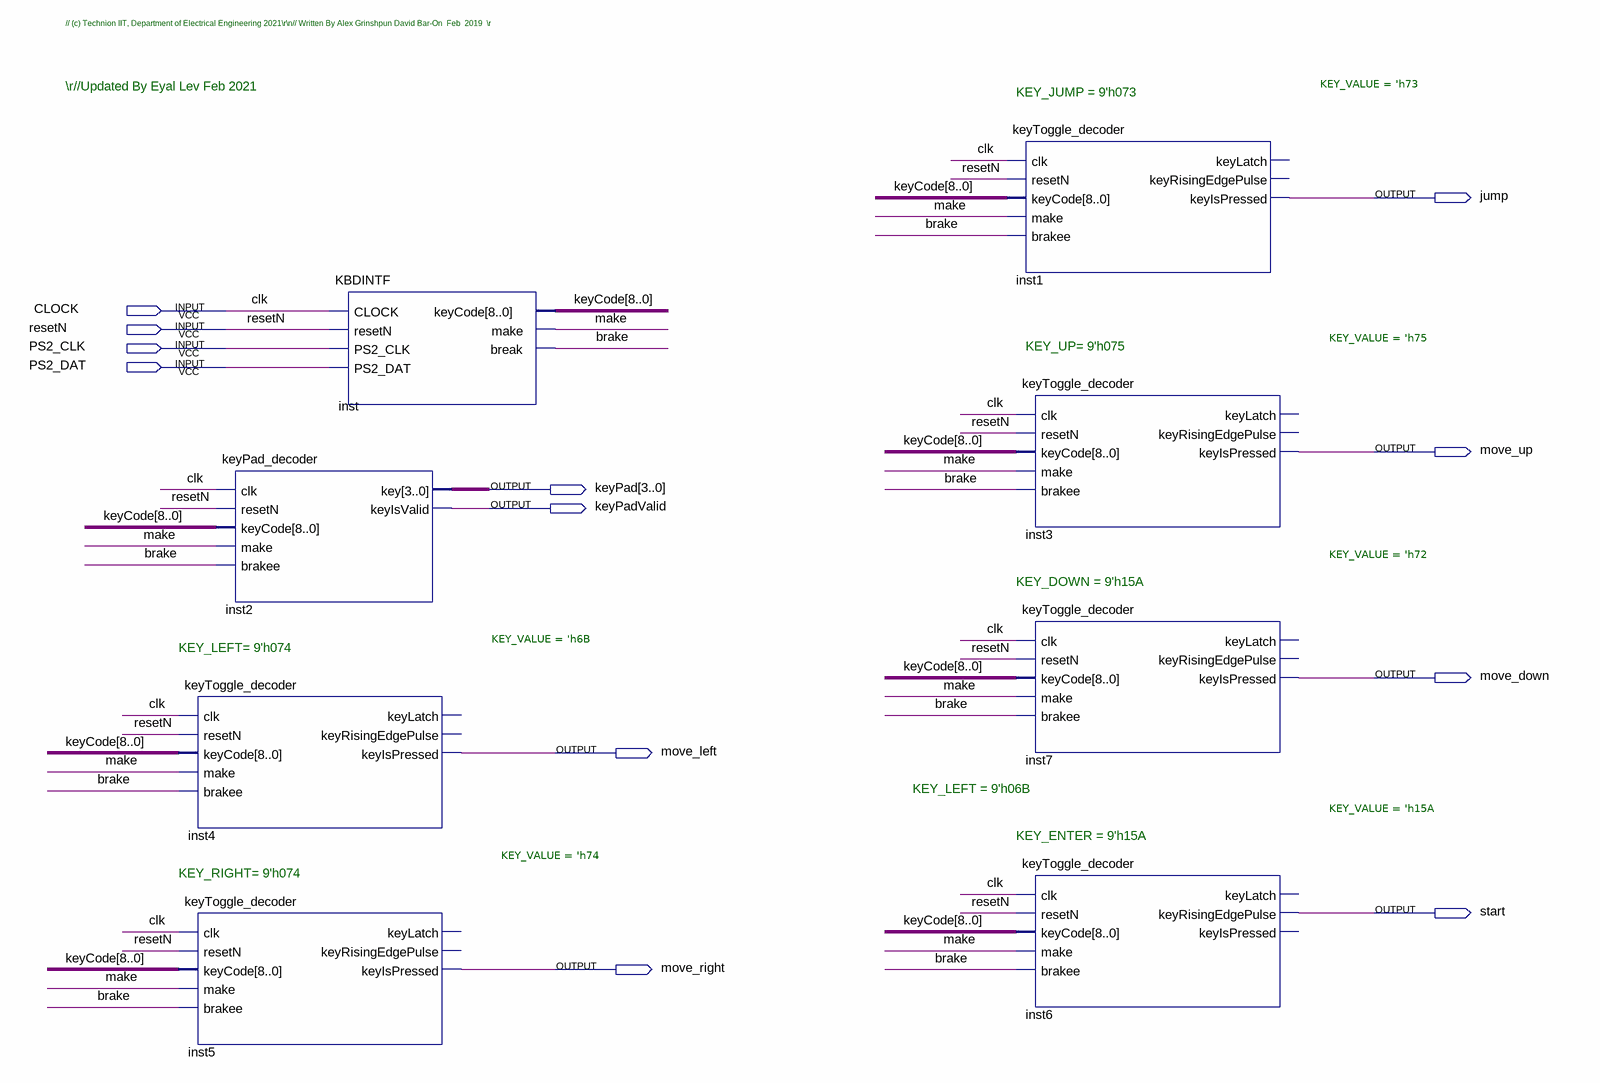
[diagram p0: schematic sheet]
// Quartus schematic KEYBOARD_INTERFACE.bdf as structural Verilog: 8 symbols, 12 pins
module KEYBOARD_INTERFACE (
  input  CLOCK,
  input  resetN,
  input  PS2_CLK,
  input  PS2_DAT,
  output jump,
  output move_up,
  output [3:0] keyPad,
  output keyPadValid,
  output move_down,
  output move_left,
  output start,
  output move_right
);

  wire brake, make;
  wire [8:0] keyCode;

  keyPad_decoder inst2 (
    .clk(CLOCK), .resetN(resetN), .keyCode(keyCode), .make(make), .brakee(brake), .key(keyPad),
    .keyIsValid(keyPadValid));
  keyToggle_decoder #(.KEY_VALUE('h6B)) inst4 (
    .clk(CLOCK), .resetN(resetN), .keyCode(keyCode), .make(make), .brakee(brake), .keyIsPressed(move_left));  // open: keyLatch, keyRisingEdgePulse
  keyToggle_decoder #(.KEY_VALUE('h74)) inst5 (
    .clk(CLOCK), .resetN(resetN), .keyCode(keyCode), .make(make), .brakee(brake), .keyIsPressed(move_right));  // open: keyLatch, keyRisingEdgePulse
  KBDINTF inst (
    .CLOCK(CLOCK), .resetN(resetN), .PS2_CLK(PS2_CLK), .PS2_DAT(PS2_DAT), .keyCode(keyCode), .make(make),
    .\break (brake));
  keyToggle_decoder #(.KEY_VALUE('h73)) inst1 (
    .clk(CLOCK), .resetN(resetN), .keyCode(keyCode), .make(make), .brakee(brake), .keyIsPressed(jump));  // open: keyLatch, keyRisingEdgePulse
  keyToggle_decoder #(.KEY_VALUE('h75)) inst3 (
    .clk(CLOCK), .resetN(resetN), .keyCode(keyCode), .make(make), .brakee(brake), .keyIsPressed(move_up));  // open: keyLatch, keyRisingEdgePulse
  keyToggle_decoder #(.KEY_VALUE('h72)) inst7 (
    .clk(CLOCK), .resetN(resetN), .keyCode(keyCode), .make(make), .brakee(brake), .keyIsPressed(move_down));  // open: keyLatch, keyRisingEdgePulse
  keyToggle_decoder #(.KEY_VALUE('h15A)) inst6 (
    .clk(CLOCK), .resetN(resetN), .keyCode(keyCode), .make(make), .brakee(brake), .keyRisingEdgePulse(start));  // open: keyLatch, keyIsPressed

  // Other names for the same wires on the sheet: clk = CLOCK

  // Notes on the sheet:
  //   // (c) Technion IIT, Department of Electrical Engineering 2021\r\n// Written By Alex Grinshpun David Bar-On  Feb  2019  \r
  //   \r//Updated By Eyal Lev Feb 2021
  //   KEY_JUMP = 9'h073
  //   KEY_UP= 9'h075
  //   KEY_DOWN = 9'h15A
  //   KEY_LEFT= 9'h074
  //   KEY_LEFT = 9'h06B
  //   KEY_ENTER = 9'h15A
  //   KEY_RIGHT= 9'h074
endmodule
